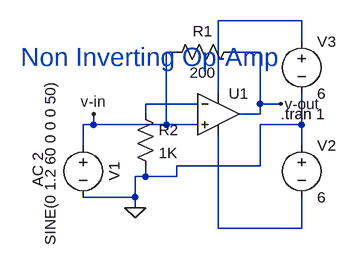
[diagram p0: schematic opAmps noninvert.asc]
opAmps noninvert.asc, the LTspice schematic file:
Version 4.1
SHEET 1 880 680
WIRE 416 -80 288 -80
WIRE 416 -48 416 -80
WIRE 224 -32 208 -32
WIRE 352 -32 304 -32
WIRE 288 32 288 -80
WIRE 256 48 176 48
WIRE 352 48 352 -32
WIRE 384 48 352 48
WIRE 176 64 176 48
WIRE 352 64 352 48
WIRE 352 64 320 64
WIRE 96 80 96 64
WIRE 96 80 80 80
WIRE 208 80 208 -32
WIRE 208 80 96 80
WIRE 256 80 208 80
WIRE 416 80 416 32
WIRE 416 80 352 80
WIRE 80 112 80 80
WIRE 416 112 416 80
WIRE 352 144 352 80
WIRE 352 144 224 144
WIRE 176 160 176 144
WIRE 176 160 160 160
WIRE 224 160 224 144
WIRE 224 160 176 160
WIRE 160 192 160 160
WIRE 160 192 80 192
WIRE 160 208 160 192
WIRE 288 240 288 96
WIRE 416 240 416 192
WIRE 416 240 288 240
FLAG 160 208 0
FLAG 384 48 v-out
FLAG 96 64 v-in
SYMBOL OpAmps\\UniversalOpAmp2 288 64 R0
SYMATTR InstName U1
SYMBOL voltage 80 96 R0
WINDOW 0 32 56 VTop 2
WINDOW 3 -35 43 VBottom 2
WINDOW 123 -54 54 VBottom 2
WINDOW 39 0 0 Left 0
SYMATTR InstName V1
SYMATTR Value SINE(0 1.2 60 0 0 0 50)
SYMATTR Value2 AC 2
SYMBOL res 320 -48 R90
WINDOW 0 0 56 VBottom 2
WINDOW 3 32 56 VTop 2
SYMATTR InstName R1
SYMATTR Value 200
SYMATTR SpiceLine tol=1 pwr=0.1
SYMBOL voltage 416 96 R0
WINDOW 123 0 0 Left 0
WINDOW 39 0 0 Left 0
SYMATTR InstName V2
SYMATTR Value 6
SYMBOL voltage 416 -64 R0
WINDOW 123 0 0 Left 0
WINDOW 39 0 0 Left 0
SYMATTR InstName V3
SYMATTR Value 6
SYMBOL res 160 48 R0
SYMATTR InstName R2
SYMATTR Value 1K
SYMATTR SpiceLine tol=1 pwr=0.1
TEXT 384 64 Left 2 !.tran 1
TEXT -16 -24 Left 4 ;Non Inverting Op-Amp

The netlist it stands for:
* opAmps noninvert.asc
X§U1 v-in N002 N001 N003 v-out level2 Avol=1Meg GBW=10Meg Slew=10Meg Ilimit=25m Rail=0 Vos=0 En=0 Enk=0 In=0 Ink=0 Rin=500Meg  ; pins In+ In- V+ V- OUT
V1 v-in 0 SINE(0 1.2 60 0 0 0 50) AC 2
R1 v-out v-in 200 tol=1 pwr=0.1
V2 0 N003 6
V3 N001 0 6
R2 N002 0 1K tol=1 pwr=0.1
.tran 1
* Non Inverting Op-Amp
.lib UniversalOpAmp2.lib
.backanno
.end